# EAGLE design schematic (EAGLE 7.7.0)
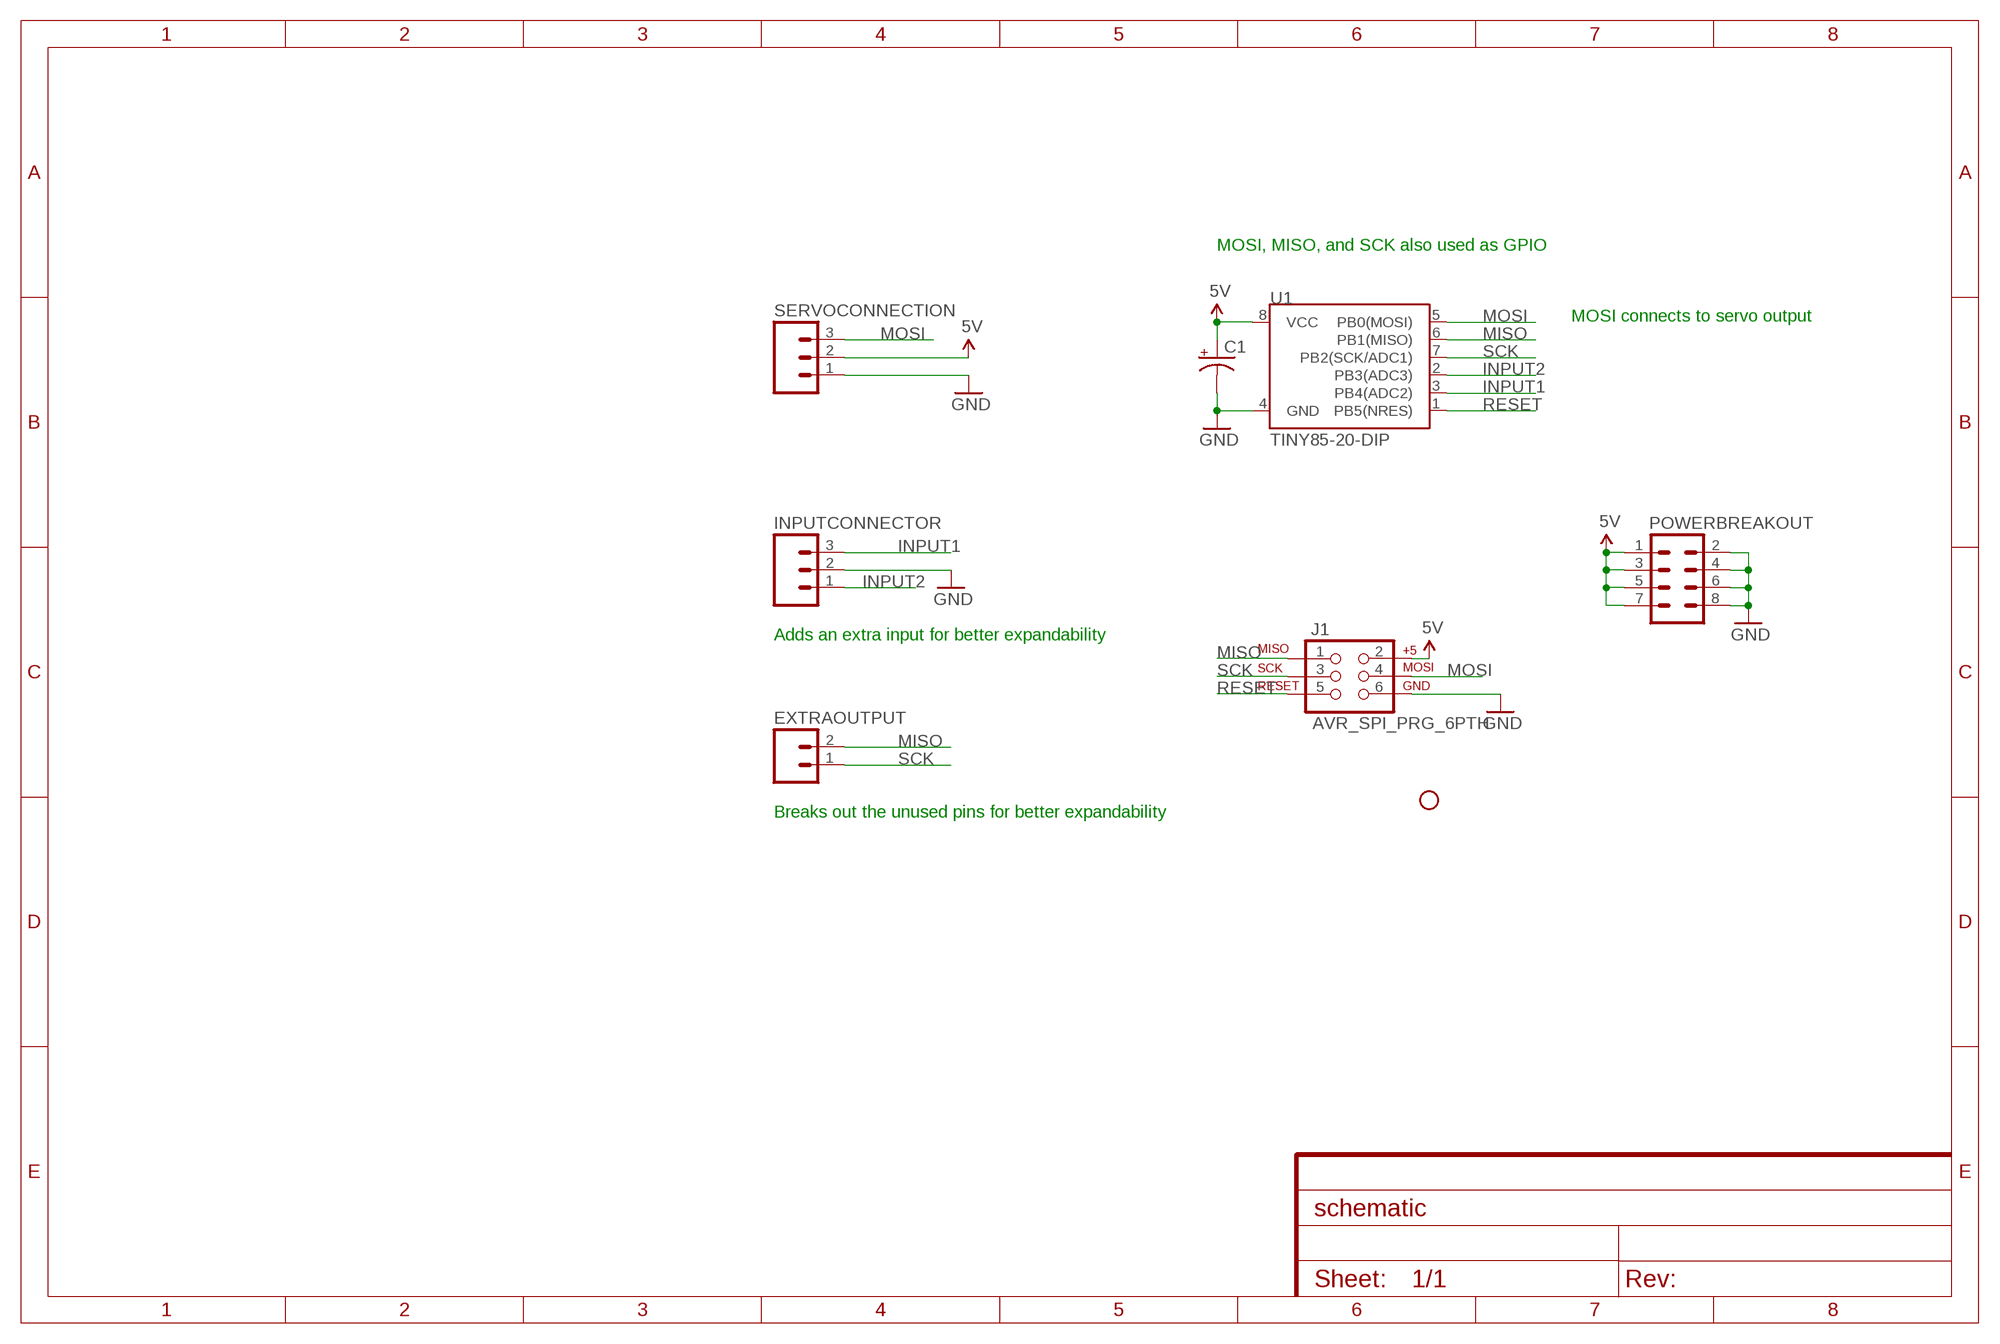
[diagram p0: schematic, sheet 1]

## Parts
C1  10UF-25V-20%(PTH)  [CPOL-RADIAL-10UF-25V]
EXTRAOUTPUT  M02PTH  [1X02]
H1  STAND-OFF  [STAND-OFF]
INPUTCONNECTOR  M03PTH  [1X03]
J1  AVR_SPI_PRG_6PTH  [2X3]
POWERBREAKOUT  M04X2  [2X4]
SERVOCONNECTION  M03PTH  [1X03]
U1  TINY85-20-DIP  ATTINY45TINY85-20-DIP  [DIP08]

## Nets
5V: C1.1(+) J1.2 POWERBREAKOUT.1 POWERBREAKOUT.3 POWERBREAKOUT.5 POWERBREAKOUT.7 SERVOCONNECTION.2 U1.8(VCC)
GND: C1.2(-) INPUTCONNECTOR.2 J1.6 POWERBREAKOUT.2 POWERBREAKOUT.4 POWERBREAKOUT.6 POWERBREAKOUT.8 SERVOCONNECTION.1 U1.4(GND)
INPUT1: INPUTCONNECTOR.3 U1.3(PB4(ADC2))
INPUT2: INPUTCONNECTOR.1 U1.2(PB3(ADC3))
MISO: EXTRAOUTPUT.2 J1.1 U1.6(PB1(MISO))
MOSI: J1.4 SERVOCONNECTION.3 U1.5(PB0(MOSI))
RESET: J1.5 U1.1(PB5(NRES))
SCK: EXTRAOUTPUT.1 J1.3 U1.7(PB2(SCK/ADC1))

## Notes on the sheet
- MOSI, MISO, and SCK also used as GPIO
- MOSI connects to servo output
- Adds an extra input for better expandability
- Breaks out the unused pins for better expandability

## Library data of the parts
C1 = SparkFun-Capacitors:10UF-25V-20%(PTH): CAP-08440; PROD_ID: CAP-08440
EXTRAOUTPUT = SparkFun-Connectors:M02: Standard 2-pin 0.1" header. Use with - straight break away headers ( PRT-00116) - right angle break away headers (PRT-00553) - swiss pins (PRT-00743) - machine pins (PRT-00117) - female headers (PRT-00115) Molex polarized connector foot print use with: PRT-08233 with associated crimp pins and housings. 2.54_SCREWTERM for use with PRT-10571. 3.5mm Screw Terminal footprints for PRT-08084 5mm Screw Terminal footprints for use with PRT-08432
H1 = SparkFun-Electromechanical:STAND-OFF: #4 Stand Off This is the mechanical footprint for a #4 phillips button head screw. Use the keepout ring to avoid running the screw head into surrounding components. SKU : PRT-00447
INPUTCONNECTOR SERVOCONNECTION = SparkFun-Connectors:M03: Header 3 Standard 3-pin 0.1" header. Use with straight break away headers (SKU : PRT-00116), right angle break away headers (PRT-00553), swiss pins (PRT-00743), machine pins (PRT-00117), and female headers (PRT-00115). Molex polarized connector foot print use with SKU : PRT-08232 with associated crimp pins and housings.
J1 = SparkFun-Connectors:AVR_SPI_PRG_6: AVR ISP 6 Pin This is the reduced ISP connector for AVR programming. Common on Arduino. This footprint will take up less PCB space and can be used with a 10-pin to 6-pin adapter such as SKU: BOB-08508 **Special note about "TEST_POINT" package. The stop mask is on the top side, so if you want your programming test points to be on the bottom of your board, make sure to place this package on the bottom side of the board. This also ensure that the orientation to program from the bottom side will be correct.
POWERBREAKOUT = SparkFun-Connectors:M04X2: .1" header, two rows of four.
U1 = SparkFun-DigitalIC:ATTINY45: Atmel 8-pin 2/4/8kB flash uC; PROD_ID: IC-09445

## Board
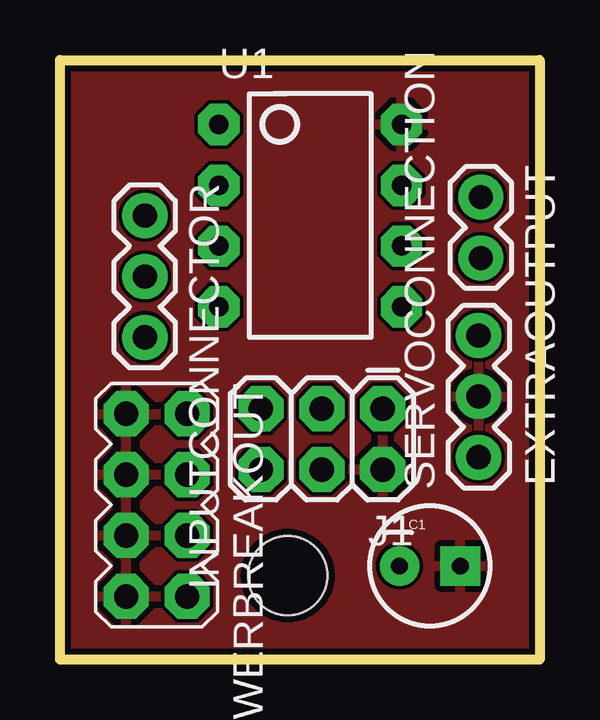
[diagram p1: board, top side]
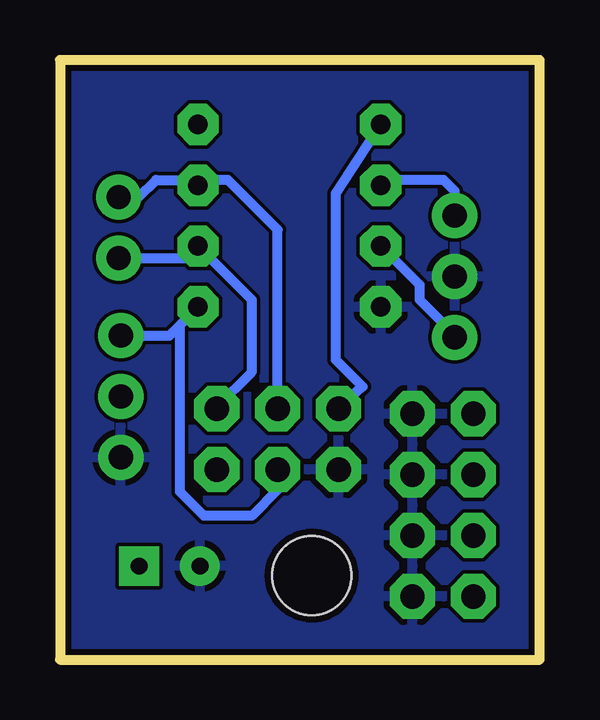
[diagram p2: board, bottom side, seen from below]

Size 20 x 25 mm. Coordinates in mm from the lower left corner, seen from the top.
Outline: 0,0 0,25 20,25 20,0 0,0
Copper layers (1*16): Top 0.035mm / dielectric 1.5mm / Bottom 0.035mm
Design rules "SeeedStudio_2layer_DRU_no_angle_20140221": minimum track width 6mil, minimum drill 12mil, track to track 6mil, track to pad 6mil, pad to pad 6mil, via to via 6mil, smd to smd 0mil, copper to edge 10mil, drill to drill 10mil, minimum pad ring 10mil, minimum via ring 6mil, stop-mask expansion 2mil, vias tented up to drill 100mil, thermal gap 10mil

### Footprints (pad centres in the part's own frame; a part is rotated, then mirrored left to right if it is on the bottom)
CPOL-RADIAL-10UF-25V = drill 0.7 pad 1.651 square: 1 1.27,0 | drill 0.7 pad 1.651: 2 -1.27,0
1X02 = drill 1.016 pad 1.88: 1 0,0; 2 2.54,0
STAND-OFF = hole 3.302: 0,0
1X03 = drill 1.016 pad 1.88: 1 0,0; 2 2.54,0; 3 5.08,0
2X3 = drill 1.016 pad 1.88 octagon: 1 0,0; 2 0,2.54; 3 2.54,0; 4 2.54,2.54; 5 5.08,0; 6 5.08,2.54
2X4 = drill 1.016 pad 1.88 octagon: 1 -3.81,-1.27; 2 -3.81,1.27; 3 -1.27,-1.27; 4 -1.27,1.27; 5 1.27,-1.27; 6 1.27,1.27; 7 3.81,-1.27; 8 3.81,1.27
DIP08 = drill 0.813 pad 1.727 octagon: 1 -3.81,-3.81; 2 -1.27,-3.81; 3 1.27,-3.81; 4 3.81,-3.81; 5 3.81,3.81; 6 1.27,3.81; 7 -1.27,3.81; 8 -3.81,3.81

### Placement (x,y rotation side)
C1  15.43,3.9 0 top
EXTRAOUTPUT  17.55,19.28 270 top
H1  9.5,3.5 0 top
INPUTCONNECTOR  3.54,18.51 270 top
J1  13.46,10.46 180 top
POWERBREAKOUT  4.03,6.44 270 top
SERVOCONNECTION  17.46,8.43 90 top
U1  10.43,18.51 270 top

### Tracks (layer width: path | path; a pad name or v marks a point on that pad's centre or on a via)
5V
  pour Top: 0,0 0,25 20,25 20,0
GND
  pour Bottom: 0,0 0,25 20,25 20,0
INPUT1
  Bottom 0.406: INPUTCONNECTOR.3 3.54,13.54 5,15 5,15.62 U1.3
INPUT2
  Bottom 0.406: INPUTCONNECTOR.1 3.54,19.54 4,20 6.4,20 U1.2
MISO
  Bottom 0.406: J1.1 13.46,10.54 12,12 12,15 U1.6 14.74,16.74 EXTRAOUTPUT.2
MOSI
  Bottom 0.406: J1.4 10.92,7.08 12,6 14,6 15,7 15,13.94 U1.5 15.43,13.51 SERVOCONNECTION.3
RESET
  Bottom 0.406: J1.5 7.38,11.38 8.5,12.5 8.5,19.44 U1.1
SCK
  Bottom 0.406: J1.3 10.92,17.92 13,20 14.02,20 U1.7 14.46,20 16,20 16.72,19.28 EXTRAOUTPUT.1